# Altium project MB1137_1.PrjPCB
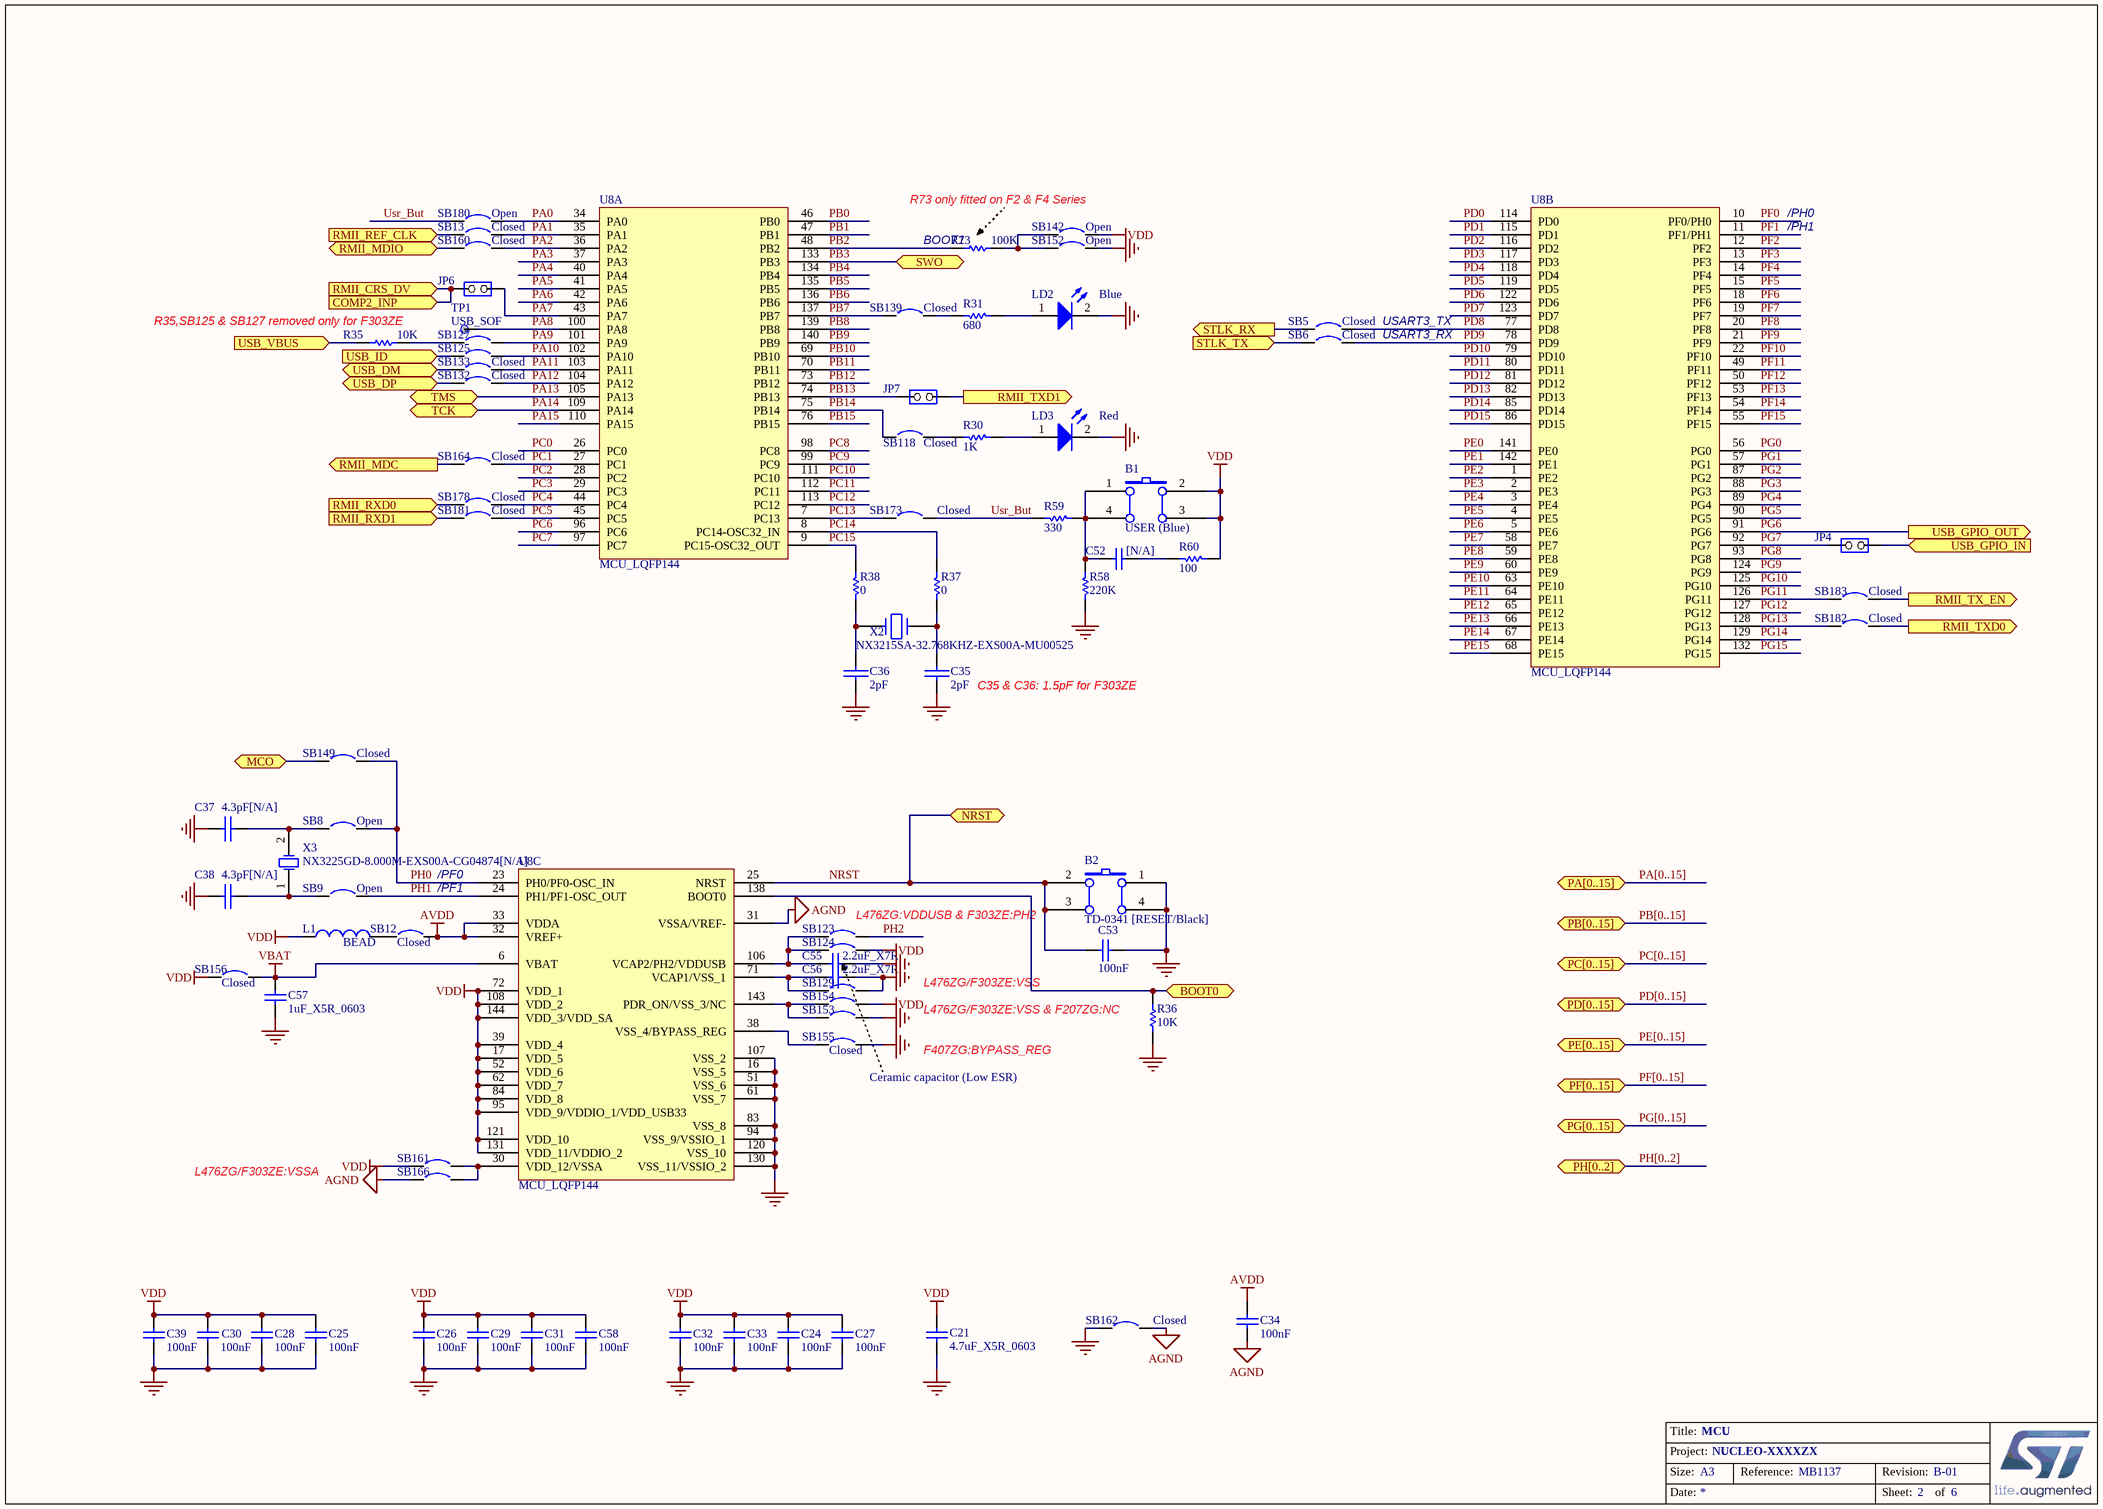
[diagram p0: MCU_144.SchDoc]
2 sheets, 98 parts. Net scope: flat (ports and power ports of the same name join across sheets).
Board file: MB1137.PcbDoc
Sheets:
  MCU_144.SchDoc
  USB.SchDoc

## Sheet MCU_144.SchDoc: MCU
size A3; DocumentNumber: MB1137; Revision: B-01; SheetNumber: 2; SheetTotal: 6; Project: NUCLEO-XXXXZX

### Parts
B1  USER (Blue)  [PB-6X6mm-Blue]
B2  TD-0341 [RESET/Black]  [PB-6X6mm-Black]
C21  4.7uF_X5R_0603  [0603C]
C24  100nF  [0603C]
C25  100nF  [0603C]
C26  100nF  [0603C]
C27  100nF  [0603C]
C28  100nF  [0603C]
C29  100nF  [0603C]
C30  100nF  [0603C]
C31  100nF  [0603C]
C32  100nF  [0603C]
C33  100nF  [0603C]
C34  100nF  [0603C]
C35  2pF  [0603C]
C36  2pF  [0603C]
C37  4.3pF[N/A]  [0603C]
C38  4.3pF[N/A]  [0603C]
C39  100nF  [0603C]
C52  [N/A]  [0603C]
C53  100nF  [0603C]
C55  2.2uF_X7R  [TAN-A]
C56  2.2uF_X7R  [TAN-A]
C57  1uF_X5R_0603  [0603C]
C58  100nF  [0603C]
JP4  (no value)  [HDR_1x2_2R54_V_M_S]
JP6  (no value)  [HDR_1x2_2R54_V_M_S]
JP7  (no value)  [HDR_1x2_2R54_V_M_S]
L1  BEAD  [0603L]
LD2  Blue  [0603D-B]
LD3  Red  [0603D-R]
R30  1K  [0603R]
R31  680  [0603R]
R35  10K  [0603R]
R36  10K  [0603R]
R37  0  [0603R]
R38  0  [0603R]
R58  220K  [0603R]
R59  330  [0603R]
R60  100  [0603R]
R73  100K  [0603R]
SB5  Closed  [SB_0603]
SB6  Closed  [SB_0603]
SB8  Open  [SB_0603]
SB9  Open  [SB_0603]
SB12  Closed  [SB_0603]
SB13  Closed  [SB_0603]
SB118  Closed  [SB_0603]
SB123  Circuit Breaker  [SB_0603]  (value not drawn)
SB124  Circuit Breaker  [SB_0603]  (value not drawn)
SB125  Circuit Breaker  [SB_0603]  (value not drawn)
SB127  Circuit Breaker  [SB_0603]  (value not drawn)
SB129  Circuit Breaker  [SB_0603]  (value not drawn)
SB132  Closed  [SB_0603]
SB133  Closed  [SB_0603]
SB139  Closed  [SB_0603]
SB142  Open  [SB_0603]
SB149  Closed  [SB_0603]
SB152  Open  [SB_0603]
SB153  Circuit Breaker  [SB_0603]  (value not drawn)
SB154  Circuit Breaker  [SB_0603]  (value not drawn)
SB155  Closed  [SB_0603]
SB156  Closed  [SB_0603]
SB160  Closed  [SB_0603]
SB161  Circuit Breaker  [SB_0603]  (value not drawn)
SB162  Closed  [SB_0603]
SB164  Closed  [SB_0603]
SB166  Circuit Breaker  [SB_0603]  (value not drawn)
SB173  Closed  [SB_0603]
SB178  Closed  [SB_0603]
SB180  Open  [SB_0603]
SB181  Closed  [SB_0603]
SB182  Closed  [SB_0603]
SB183  Closed  [SB_0603]
TP1  USB_SOF  [TP]
U8  MCU_LQFP144  [LQFP144_0R5_SKT]  (parts A,B,C of 3)
X2  NX3215SA-32.768KHZ-EXS00A-MU00525  [XTAL_2SM_3R2X1R5]
X3  NX3225GD-8.000M-EXS00A-CG04874[N/A]  [OSC_2SM_3R2x2R5]

### Ports
BOOT0, COMP2_INP (in), MCO, NRST, PA[0..15] (bidir), PB[0..15] (bidir), PC[0..15] (bidir), PD[0..15] (bidir), PE[0..15] (bidir), PF[0..15] (bidir), PG[0..15] (bidir), PH[0..2] (bidir), RMII_CRS_DV (in), RMII_MDC (out), RMII_MDIO (bidir), RMII_REF_CLK (in), RMII_RXD0 (in), RMII_RXD1 (in), RMII_TX_EN (out), RMII_TXD0 (out), RMII_TXD1 (out), STLK_RX (out), STLK_TX (in), SWO, TCK, TMS, USB_DM (bidir), USB_DP (bidir), USB_GPIO_IN (in), USB_GPIO_OUT (out), USB_ID (in), USB_VBUS (in)

### Nets
AGND: C34.2 SB162.2 SB166.1 U8.31(VSSA/VREF-)
AVDD: C34.1 SB12.2 U8.32(VREF+) U8.33(VDDA)
GND: B2.1(A0) B2.4(A1) C21.2 C24.2 C25.2 C26.2 C27.2 C28.2 C29.2 C30.2 C31.2 C32.2 C33.2 C35.2 C36.2 C37.2 C38.2 C39.2 C53.1 C55.2 C56.2 C57.2 C58.2 LD2.2(K) LD3.2(K) R36.2 R58.2 SB129.2 SB152.2 SB153.2 SB155.2 SB162.1 U8.16(VSS_5) U8.51(VSS_6) U8.61(VSS_7) U8.83(VSS_8) U8.94(VSS_9/VSSIO_1) U8.107(VSS_2) U8.120(VSS_10) U8.130(VSS_11/VSSIO_2)
VBAT: C57.1 SB156.2 U8.6(VBAT)
VDD: B1.2(B0) B1.3(B1) C21.1 C24.1 C25.1 C26.1 C27.1 C28.1 C29.1 C30.1 C31.1 C32.1 C33.1 C39.1 C58.1 L1.1 R60.1 SB124.2 SB142.2 SB154.2 SB156.1 SB161.1 U8.17(VDD_5) U8.39(VDD_4) U8.52(VDD_6) U8.62(VDD_7) U8.72(VDD_1) U8.84(VDD_8) U8.95(VDD_9/VDDIO_1/VDD_USB33) U8.108(VDD_2) U8.121(VDD_10) U8.131(VDD_11/VDDIO_2) U8.144(VDD_3/VDD_SA)
NRST: B2.2(B0) B2.3(B1) C53.2 U8.25(NRST) ; port NRST
PA0: SB180.2 U8.34(PA0)
PA1: SB13.2 U8.35(PA1)
PA2: SB160.2 U8.36(PA2)
PA3: U8.37(PA3)
PA4: U8.40(PA4)
PA5: U8.41(PA5)
PA6: U8.42(PA6)
PA7: JP6.1(COMMON) U8.43(PA7)
PA8: TP1.1 U8.100(PA8)
PA9: SB127.2 U8.101(PA9)
PA10: SB125.2 U8.102(PA10)
PA11: SB133.2 U8.103(PA11)
PA12: SB132.2 U8.104(PA12)
PA13: U8.105(PA13) ; port TMS
PA14: U8.109(PA14) ; port TCK
PA15: U8.110(PA15)
PB0: U8.46(PB0)
PB1: U8.47(PB1)
PB2: R73.1 U8.48(PB2)
PB3: U8.133(PB3) ; port SWO
PB4: U8.134(PB4)
PB5: U8.135(PB5)
PB6: U8.136(PB6)
PB7: SB139.1 U8.137(PB7)
PB8: U8.139(PB8)
PB9: U8.140(PB9)
PB10: U8.69(PB10)
PB11: U8.70(PB11)
PB12: U8.73(PB12)
PB13: JP7.2(NO) U8.74(PB13)
PB14: SB118.1 U8.75(PB14)
PB15: U8.76(PB15)
PC0: U8.26(PC0)
PC1: SB164.2 U8.27(PC1)
PC2: U8.28(PC2)
PC3: U8.29(PC3)
PC4: SB178.2 U8.44(PC4)
PC5: SB181.2 U8.45(PC5)
PC6: U8.96(PC6)
PC7: U8.97(PC7)
PC8: U8.98(PC8)
PC9: U8.99(PC9)
PC10: U8.111(PC10)
PC11: U8.112(PC11)
PC12: U8.113(PC12)
PC13: SB173.1 U8.7(PC13)
PC14: R37.2 U8.8(PC14-OSC32_IN)
PC15: R38.2 U8.9(PC15-OSC32_OUT)
PD0: U8.114(PD0)
PD1: U8.115(PD1)
PD2: U8.116(PD2)
PD3: U8.117(PD3)
PD4: U8.118(PD4)
PD5: U8.119(PD5)
PD6: U8.122(PD6)
PD7: U8.123(PD7)
PD8: SB5.2 U8.77(PD8)
PD9: SB6.2 U8.78(PD9)
PD10: U8.79(PD10)
PD11: U8.80(PD11)
PD12: U8.81(PD12)
PD13: U8.82(PD13)
PD14: U8.85(PD14)
PD15: U8.86(PD15)
PE0: U8.141(PE0)
PE1: U8.142(PE1)
PE2: U8.1(PE2)
PE3: U8.2(PE3)
PE4: U8.3(PE4)
PE5: U8.4(PE5)
PE6: U8.5(PE6)
PE7: U8.58(PE7)
PE8: U8.59(PE8)
PE9: U8.60(PE9)
PE10: U8.63(PE10)
PE11: U8.64(PE11)
PE12: U8.65(PE12)
PE13: U8.66(PE13)
PE14: U8.67(PE14)
PE15: U8.68(PE15)
PF0: U8.10(PF0/PH0)
PF1: U8.11(PF1/PH1)
PF2: U8.12(PF2)
PF3: U8.13(PF3)
PF4: U8.14(PF4)
PF5: U8.15(PF5)
PF6: U8.18(PF6)
PF7: U8.19(PF7)
PF8: U8.20(PF8)
PF9: U8.21(PF9)
PF10: U8.22(PF10)
PF11: U8.49(PF11)
PF12: U8.50(PF12)
PF13: U8.53(PF13)
PF14: U8.54(PF14)
PF15: U8.55(PF15)
PG0: U8.56(PG0)
PG1: U8.57(PG1)
PG2: U8.87(PG2)
PG3: U8.88(PG3)
PG4: U8.89(PG4)
PG5: U8.90(PG5)
PG6: U8.91(PG6) ; port USB_GPIO_OUT
PG7: JP4.2(NO) U8.92(PG7)
PG8: U8.93(PG8)
PG9: U8.124(PG9)
PG10: U8.125(PG10)
PG11: SB183.1 U8.126(PG11)
PG12: U8.127(PG12)
PG13: SB182.1 U8.128(PG13)
PG14: U8.129(PG14)
PG15: U8.132(PG15)
PH0: SB8.2 SB149.2 U8.23(PH0/PF0-OSC_IN)
PH1: SB9.2 U8.24(PH1/PF1-OSC_OUT)
PH2: SB123.2
Usr_But: R59.2 SB173.2 SB180.1
NetB1_1: B1.1(A0) B1.4(A1) C52.2 R58.1 R59.1
NetC35_1: C35.1 R37.1 X2.2
NetC36_1: C36.1 R38.1 X2.1
NetC37_1: C37.1 SB8.1 X3.2(OSC2)
NetC38_1: C38.1 SB9.1 X3.1(OSC1)
NetC52_1: C52.1 R60.2
NetC54_1: R35.1 ; port USB_VBUS
NetC55_1: C55.1 SB123.1 SB124.1 U8.106(VCAP2/PH2/VDDUSB)
NetC56_1: C56.1 SB129.1 U8.71(VCAP1/VSS_1)
NetCN13_2: SB133.1 ; port USB_DM
NetCN13_3: SB132.1 ; port USB_DP
NetCN13_4: SB125.1 ; port USB_ID
NetJP4_1: JP4.1(COMMON) ; port USB_GPIO_IN
NetJP6_2: JP6.2(NO) ; port RMII_CRS_DV, port COMP2_INP
NetJP7_1: JP7.1(COMMON) ; port RMII_TXD1
NetL1_2: L1.2 SB12.1
NetLD2_1: LD2.1(A) R31.2
NetLD3_1: LD3.1(A) R30.2
NetR30_1: R30.1 SB118.2
NetR31_1: R31.1 SB139.2
NetR35_2: R35.2 SB127.1
NetR36_1: R36.1 U8.138(BOOT0) ; port BOOT0
NetR73_2: R73.2 SB142.1 SB152.1
NetSB5_1: SB5.1 ; port STLK_RX
NetSB6_1: SB6.1 ; port STLK_TX
NetSB13_1: SB13.1 ; port RMII_REF_CLK
NetSB149_1: SB149.1 ; port MCO
NetSB153_1: SB153.1 SB154.1 U8.143(PDR_ON/VSS_3/NC)
NetSB155_1: SB155.1 U8.38(VSS_4/BYPASS_REG)
NetSB160_1: SB160.1 ; port RMII_MDIO
NetSB161_2: SB161.2 SB166.2 U8.30(VDD_12/VSSA)
NetSB164_1: SB164.1 ; port RMII_MDC
NetSB178_1: SB178.1 ; port RMII_RXD0
NetSB181_1: SB181.1 ; port RMII_RXD1
NetSB182_2: SB182.2 ; port RMII_TXD0
NetSB183_2: SB183.2 ; port RMII_TX_EN

### Buses and harness runs
bus PA[0..15] = port PA[0..15]
bus PB[0..15] = port PB[0..15]
bus PC[0..15] = port PC[0..15]
bus PD[0..15] = port PD[0..15]
bus PE[0..15] = port PE[0..15]
bus PF[0..15] = port PF[0..15]
bus PG[0..15] = port PG[0..15]
bus PH[0..2] = port PH[0..2]

### Notes on the sheet
- R73 only fitted on F2 & F4 Series
- (near R73) BOOT1
- /PH0
- /PH1
- (near R35) R35,SB125 & SB127 removed only for F303ZE
- USART3_TX
- USART3_RX
- (near C35) C35 & C36: 1.5pF for F303ZE
- /PF0
- /PF1
- (near SB123) L476ZG:VDDUSB & F303ZE:PH2
- L476ZG/F303ZE:VSS
- L476ZG/F303ZE:VSS & F207ZG:NC
- F407ZG:BYPASS_REG
- (near SB155) Ceramic capacitor (Low ESR)
- L476ZG/F303ZE:VSSA
- Title:
- Project:
- Size:
- Date:
- A3
- Reference:
- Sheet:
- Revision:
- of

### Library data of the parts
B1 B2 = SW PUSHBUTTON: SE PUSHBUTTON
C21 = CAP SMD 0603  X5R 1µF 25V 10%: 0603  X5R 4.7uF; Value: 1µF; Rated voltage: 25V; Tolerance: 10%; Manufacturer: *; Manufacturer P/N: *; Order code Farnell: 1288202RL; Power: *; Technology: X5R; Temperature  Factor: *; Temperature Max: +125°C; Temperature Min: -55°C; STS Code: *
C24-C34 C39 C58 = Cap: Capacitor; Value: 10nF; Published: 8-Jun-2000; Revision: July-2002: Re-released for DXP Platform.; Publisher: Altium Limited
C35-C38 = CAP: Capacitor
C52 C53 = CAP: Capacitor; Value: 100pF; Published: 8-Jun-2000; Revision: July-2002: Re-released for DXP Platform.; Publisher: Altium Limited
C55 C56 = Cap_2.2uF_X7R_10%_0805: Capacitor,2.2uF,16V, X7R,10%,0805,YAGEO; Manuf_Part_1: CC0805KKX7R7BB225; Revision: July-2002: Re-released for DXP Platform.; Value: 2.2uF; Order: CC0805KKX7R7BB225; Manuf_1: YAGEO
C57 = CAP SMD 0603  X5R 1µF 25V 10%: 0603  X5R 1µF; Rated voltage: 25V; Tolerance: 10%; Manufacturer: *; Manufacturer P/N: *; Order code Farnell: 1288202RL; Value: 1µF; Power: *; Technology: X5R; Temperature  Factor: *; Temperature Max: +125°C; Temperature Min: -55°C; STS Code: *
JP4 JP6 JP7 = JP2
L1 = Inductor: Value: 100uH; Published: 8-Jun-2000; Revision: July-2002: Re-released for DXP Platform.; Publisher: Altium Limited
LD2 LD3 = LED2: Typical RED, GREEN, YELLOW, AMBER GaAs LED; Published: 8-Jun-2000; Revision: July-2002: Re-released for DXP Platform.; Publisher: Altium Limited
R30 = Res1: Resistor; Published: 8-Jun-2000; Revision: July-2002: Re-released for DXP Platform.; Publisher: Altium Limited; Value: 1K
R31 R37 R38 R59 R60 = Res1: Resistor; Value: 1K; Published: 8-Jun-2000; Revision: July-2002: Re-released for DXP Platform.; Publisher: Altium Limited
R35 = Resistor_ST: Resistor 0402 / 0603 / 0805; Value: 10K
R36 R58 R73 = res1: Resistor; Value: 1K; Published: 8-Jun-2000; Revision: July-2002: Re-released for DXP Platform.; Publisher: Altium Limited
SB5 SB6 SB12 SB13 SB118 SB132 SB133 SB139 SB149 SB155 SB156 SB160 SB162 SB164 SB173 SB178 SB181-SB183 = Circuit Breaker_close: Circuit Breaker; Published: 24-Mar-1999; Revision: July-2002: Re-released for DXP Platform.; Publisher: Altium Limited
SB8 SB9 SB142 SB152 SB180 = Circuit Breaker: Published: 24-Mar-1999; Revision: July-2002: Re-released for DXP Platform.; Publisher: Altium Limited
SB123-SB125 SB127 SB129 SB153 SB154 SB161 SB166 = Circuit Breaker: Solder: NO; Published: 24-Mar-1999; Revision: July-2002: Re-released for DXP Platform.; Publisher: Altium Limited
TP1 = TP
X2 = CRYSTAL_32K: Crystal
X3 = XTAL: Crystal Oscillator; Published: 8-Jun-2000; LatestRevisionDate: 17-Jul-2002; LatestRevisionNote: Re-released for DXP Platform.; PackageReference: R38; Publisher: Altium Limited

## Sheet USB.SchDoc: USB
size A4; DocumentNumber: MB1137; Revision: B-01; SheetNumber: 4; SheetTotal: 6; Project: NUCLEO-XXXXZX
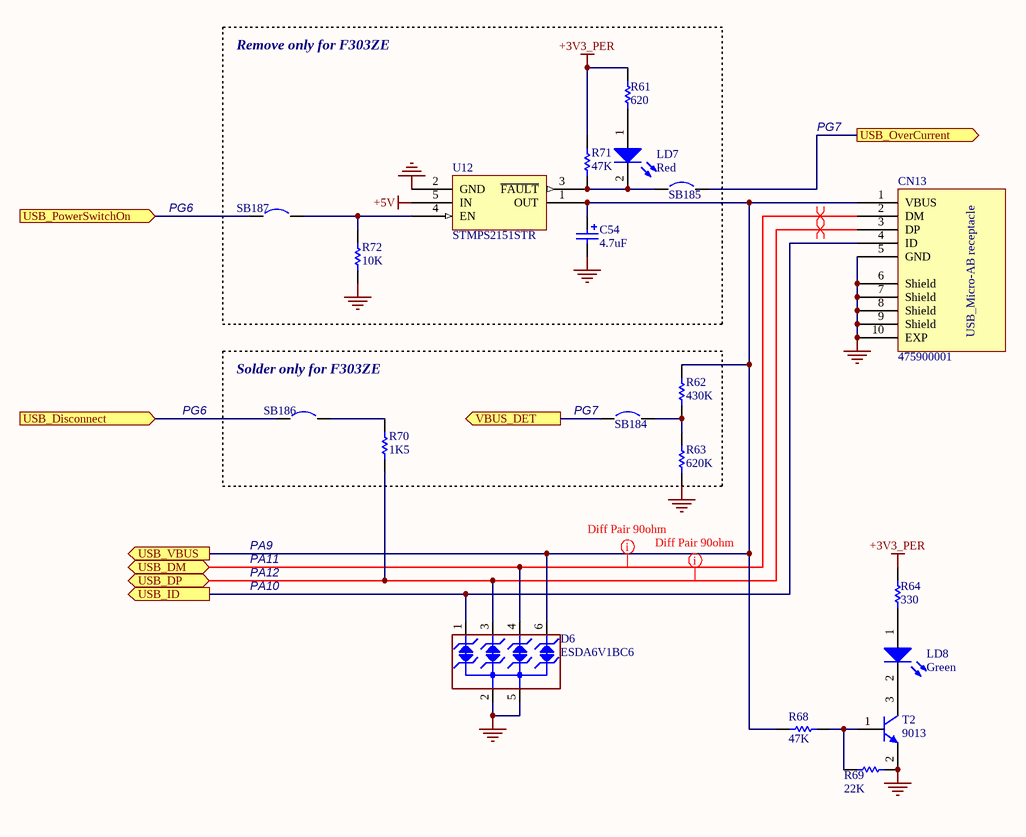
[diagram p1: USB.SchDoc]

### Parts
C54  4.7uF  [TAN-A]
CN13  475900001  [MOLEX_47590001]
D6  ESDA6V1BC6  [SOT23-6L]
LD7  Red  [0603D-R]
LD8  Green  [0603D-G]
R61  620  [0603R]
R62  430K  [0603R]
R63  620K  [0603R]
R64  330  [0603R]
R68  47K  [0603R]
R69  22K  [0603R]
R70  1K5  [0603R]
R71  47K  [0603R]
R72  10K  [0603R]
SB184  Circuit Breaker  [SB_0603]  (value not drawn)
SB185  Circuit Breaker  [SB_0603]  (value not drawn)
SB186  Circuit Breaker  [SB_0603]  (value not drawn)
SB187  Circuit Breaker  [SB_0603]  (value not drawn)
T2  9013  [SOT-23]
U12  STMPS2151STR  [SOT-23-5L]

### Blocks framed on the sheet
Remove only for F303ZE: C54 LD7 R61 R71 R72 SB185 SB187 U12
Solder only for F303ZE: R62 R63 R70 SB184 SB186

### Ports
USB_Disconnect (in), USB_DM (bidir), USB_DP (bidir), USB_ID (out), USB_OverCurrent (out), USB_PowerSwitchOn (in), USB_VBUS (out), VBUS_DET (out)

### Nets
+3V3_PER: R61.2 R64.2 R71.1
+5V: U12.5(IN)
GND: C54.2 CN13.5(GND) CN13.6(Shield) CN13.7(Shield) CN13.8(Shield) CN13.9(Shield) CN13.10(EXP) D6.2(IO2) D6.5(IO4) R63.2 R69.1 R72.1 T2.2(E) U12.2(GND)
NetC54_1: C54.1 CN13.1(VBUS) D6.6(NC) R62.1 R68.1 U12.1(OUT) ; port USB_VBUS
NetCN13_2: CN13.2(DM) D6.4(IO3) ; port USB_DM
NetCN13_3: CN13.3(DP) D6.3(GND) R70.1 ; port USB_DP
NetCN13_4: CN13.4(ID) D6.1(IO1) ; port USB_ID
NetLD7_1: LD7.1(A) R61.1
NetLD7_2: LD7.2(K) R71.2 SB185.1 U12.3(~{FAULT})
NetLD8_1: LD8.1(A) R64.1
NetLD8_2: LD8.2(K) T2.3(C)
NetR62_2: R62.2 R63.1 SB184.2
NetR68_2: R68.2 R69.2 T2.1(B)
NetR70_2: R70.2 SB186.2
NetR72_2: R72.2 SB187.2 U12.4(EN)
NetSB184_1: SB184.1 ; port VBUS_DET
NetSB185_2: SB185.2 ; port USB_OverCurrent
NetSB186_1: SB186.1 ; port USB_Disconnect
NetSB187_1: SB187.1 ; port USB_PowerSwitchOn

### Layout directives
mark named Diff Pair 90ohm: NetCN13_2, NetCN13_3
differential pair: NetCN13_2, NetCN13_3

### Notes on the sheet
- PG7
- PG6
- (near SB184) PG7
- PA9
- PA12
- PA11
- PA10
- Title:
- Project:
- Size:
- Date:
- A4
- Reference:
- Sheet:
- Revision:
- of
- (in symbol 475900001) USB_Micro-AB receptacle

### Library data of the parts
C54 = Cap Pol1: Polarized Capacitor (Radial); Value: 47uF; Published: 8-Jun-2000; Revision: July-2002: Re-released for DXP Platform.; Publisher: Altium Limited
D6 = ESDA6V1BC6: 4-line ESD protection; Manuf_1: STM; Manuf_Part_1: ESDA5V3L; Ref St: 9179034; Provided: ST; ECCN_US/EU: EAR99/NEC; Distrib: ST; Order: ESDA5V3L; Ordered by: STM
LD7 LD8 = LED2: as LD2 on sheet MCU_144; Published: 8-Jun-2000; Revision: July-2002: Re-released for DXP Platform.; Publisher: Altium Limited
R61 R72 = Res1: Resistor; Value: 1K; Published: 8-Jun-2000; Revision: July-2002: Re-released for DXP Platform.; Publisher: Altium Limited
R62-R64 R68 R69 R71 = res1: Resistor; Value: 1K; Published: 8-Jun-2000; Revision: July-2002: Re-released for DXP Platform.; Publisher: Altium Limited
R70 = Resistor_ST: Resistor 0402 / 0603 / 0805; Value: 10K
SB184-SB187 = Circuit Breaker: Solder: NO; Published: 24-Mar-1999; Revision: July-2002: Re-released for DXP Platform.; Publisher: Altium Limited
T2 = NPN: NPN Bipolar Transistor; Code - JEDEC: TO-226-AA; Published: 8-Jun-2000; Revision: July-2002: Re-released for DXP Platform.; Publisher: Altium Limited
U12 = STMPS2141STR

## Nets that join several sheets
GND: MCU_144 (40 pins), USB (14 pins)
NetC54_1: MCU_144 (R35.1), USB (6 pins)
NetCN13_2: MCU_144 (SB133.1), USB (CN13.2 D6.4)
NetCN13_3: MCU_144 (SB132.1), USB (CN13.3 D6.3 R70.1)
NetCN13_4: MCU_144 (SB125.1), USB (CN13.4 D6.1)